# Altium schematic sheet SECONDARY_POWER.SchDoc
size 420 x 297 mm; SheetNumber: 7; SheetTotal: 19
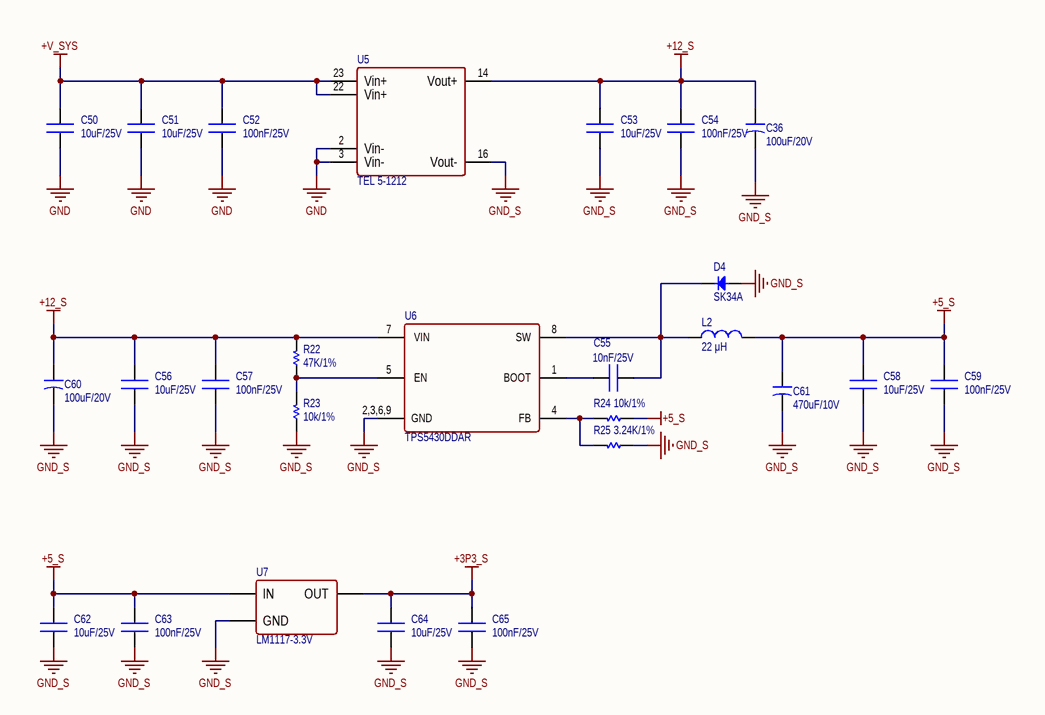
[diagram p0: SECONDARY_POWER.SchDoc]

## Parts
C36  100uF/20V  [Tantalum 2917]
C50  10uF/25V  [CN-SMD-0603]
C51  10uF/25V  [CN-SMD-0603]
C52  100nF/25V  [CN-SMD-0603]
C53  10uF/25V  [CN-SMD-0603]
C54  100nF/25V  [CN-SMD-0603]
C55  10nF/25V  [CN-SMD-0603]
C56  10uF/25V  [CN-SMD-0603]
C57  100nF/25V  [CN-SMD-0603]
C58  10uF/25V  [CN-SMD-0603]
C59  100nF/25V  [CN-SMD-0603]
C60  100uF/20V  [Tantalum 2917]
C61  470uF/10V  [Tantalum 2917]
C62  10uF/25V  [CN-SMD-0603]
C63  100nF/25V  [CN-SMD-0603]
C64  10uF/25V  [CN-SMD-0603]
C65  100nF/25V  [CN-SMD-0603]
D4  SK34A  [DIO-SMD-A]
L2  22 μH  [PSM6050]
R22  47K/1%  [RES-SMD-0603]
R23  10k/1%  [RES-SMD-0603]
R24  10k/1%  [RES-SMD-0603]
R25  3.24K/1%  [RES-SMD-0603]
U5  TEL 5-1212  [TEL_5-XXYY_SINGLE]
U6  TPS5430DDAR  [HSOP8]
U7  LM1117-3.3V  [SOT223]

## Nets
+3P3_S: C64.2 C65.2 U7.2,4(OUT)
+5_S: C58.2 C59.2 C61.1 C62.2 C63.2 L2.2 R24.1 U7.3(IN)
+12_S: C36.1 C53.2 C54.2 C56.2 C57.2 C60.1 R22.2 U5.14(Vout+) U6.7(VIN)
+V_SYS: C50.2 C51.2 C52.2 U5.22(Vin+) U5.23(Vin+)
GND: C50.1 C51.1 C52.1 U5.2(Vin-) U5.3(Vin-)
GND_S: C36.2 C53.1 C54.1 C56.1 C57.1 C58.1 C59.1 C60.2 C61.2 C62.1 C63.1 C64.1 C65.1 D4.1(A) R23.1 R25.1 U5.16(Vout-) U6.2,3,6,9(GND) U7.1(GND)
NetC55_1: C55.1 D4.2(K) L2.1 U6.8(SW)
NetC55_2: C55.2 U6.1(BOOT)
NetR22_1: R22.1 R23.2 U6.5(EN)
NetR24_2: R24.2 R25.2 U6.4(FB)

## Notes on the sheet
- Project:
- Sub-system:
- Design by:
- Sheet title:
- Sheet
- of
- Checked by:
- Approved by:
- Document No:
- Revision:
- Size:
- Date:

## Library data of the parts
C36 C60 = CN-SMD: CAP TANT 100UF 10% 20V 2917; PN: TAJD107K020RNJ; LatestRevisionDate: 17-Jul-2002; LatestRevisionNote: Re-released for DXP Platform.; PackageReference: POLAR0.8; Publisher: Altium Limited
C50 C51 C53 C56 C58 C62 C64 = CN: CAP CER 10UF 25V X5R 0603; PN: CL10A106MA8NRNC
C52 C54 C57 C59 C63 C65 = CN: CAP CER 0.1UF 25V X7R 0603; PN: CL10B104KA8NNNC
C55 = CN: CAP CER 10000PF 25V X7R 0603; PN: CL10B103KB8NNNC
C61 = CN-SMD: CAP TANT 470UF 10% 10V 2917; PN: TAJE477K010RNJ; LatestRevisionDate: 17-Jul-2002; LatestRevisionNote: Re-released for DXP Platform.; PackageReference: POLAR0.8; Publisher: Altium Limited
D4 = Diode SMD: DIODE SCHOTTKY 40V 3A DO214AC; Code - JEDEC: DO-214-AB; Published: 8-Jun-2000; Revision: July-2002: Re-released for DXP Platform.; Publisher: Altium Limited; PN: SK34A
L2 = L-SMD-1: FIXED IND 22UH 2.5A 170 MOHM SMD, P/N: SRP7050TA-220M; Manufacturer: Wurth Elektronik; PN: SRP7050TA-220M; Inductance: 22 μH; ComponentLink1Description: Manufacturer; ComponentLink1URL: http://www.we-online.de; Created by: Baojun Chen; Created Date: Nov.2015; ComponentLink2Description: Datasheet; ComponentLink2URL: http://katalog.we-online.de/pbs/datasheet/78477010.pdf
R22 = Res-SMD: RES SMD 47K OHM 1% 1/10W 0603; Manufacturer: Generic Components; PN: ERJ-3EKF4702V; Class: Passive; Publisher: Altium Hobart Technology Centre
R23 R24 = Res-SMD: RES SMD 10K OHM 1% 1/10W 0603; Manufacturer: Generic Components; PN: ERJ-3EKF1002V; Class: Passive; Publisher: Altium Hobart Technology Centre
R25 = Res-SMD: RES SMD 3.24K OHM 1% 1/10W 0603; Manufacturer: Generic Components; PN: ERJ-3EKF3241V; Class: Passive; Publisher: Altium Hobart Technology Centre
U5 = TEL 5-1212: DC DC CONVERTER 12V 6W; PN: TEL 5-1212
U6 = TPS5430: IC REG BUCK ADJ 3A 8SOPWR; PN: TPS5430DDAR
U7 = LM1117: IC REG LIN 3.3V 800MA SOT-223-4; PN: TLV1117-33IDCYR; Website: http://group3i.net